# EAGLE design CO5-AT (EAGLE 9.6.2)
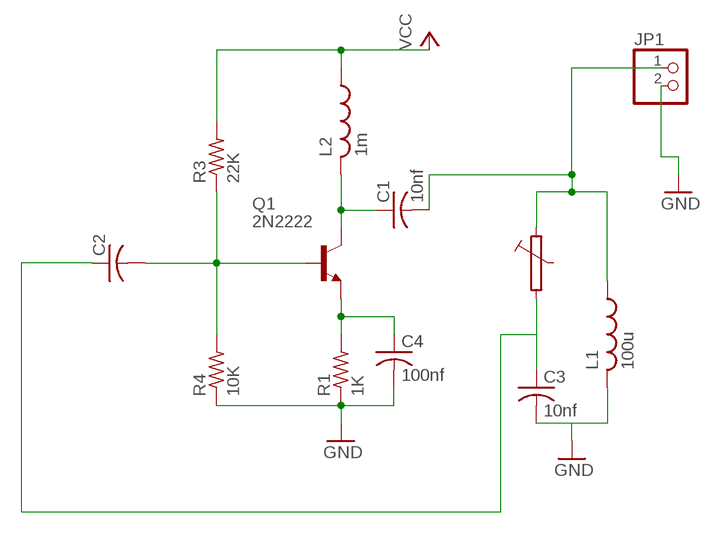
[diagram p0: schematic, sheet 1]

## Parts
C1  10nf  C-US050-025X075  [C050-025X075]
C2  C-US050-025X075  [C050-025X075]
C3  10nf  C-US050-025X075  [C050-025X075]
C4  100nf  C-US050-025X075  [C050-025X075]
JP1  PINHD-1X2  [1X02]
L1  100u  L-US0207/10  [0207/10]
L2  1m  L-US0207/10  [0207/10]
Q1  2N2222  [TO18]
R1  1K  R-US_0207/10  [0207/10]
R3  22K  R-US_0207/10  [0207/10]
R4  10K  R-US_0207/10  [0207/10]

## Nets
GND: C4.2 JP1.2 R1.1 R4.1
N$1: C1.1 L2.2 Q1.3(C)
N$2: C4.1 Q1.1(E) R1.2
N$3: C2.2 Q1.2(B) R3.1 R4.2
N$4: C2.1
N$5: C3.1
N$6: C1.2 JP1.1 L1.1
N$8: C3.2 L1.2
VCC: L2.1 R3.2

## Library data of the parts
C1-C4 = rcl:C-US: CAPACITOR, American symbol; SPICEPREFIX: C
JP1 = pinhead:PINHD-1X2: PIN HEADER
L1 L2 = rcl:L-US: INDUCTOR, American symbol; SPICEPREFIX: L
Q1 = transistor-npn:2N2222*: NPN Transistor
R1 R3 R4 = rcl:R-US_: RESISTOR, American symbol; SPICEPREFIX: R

## Board
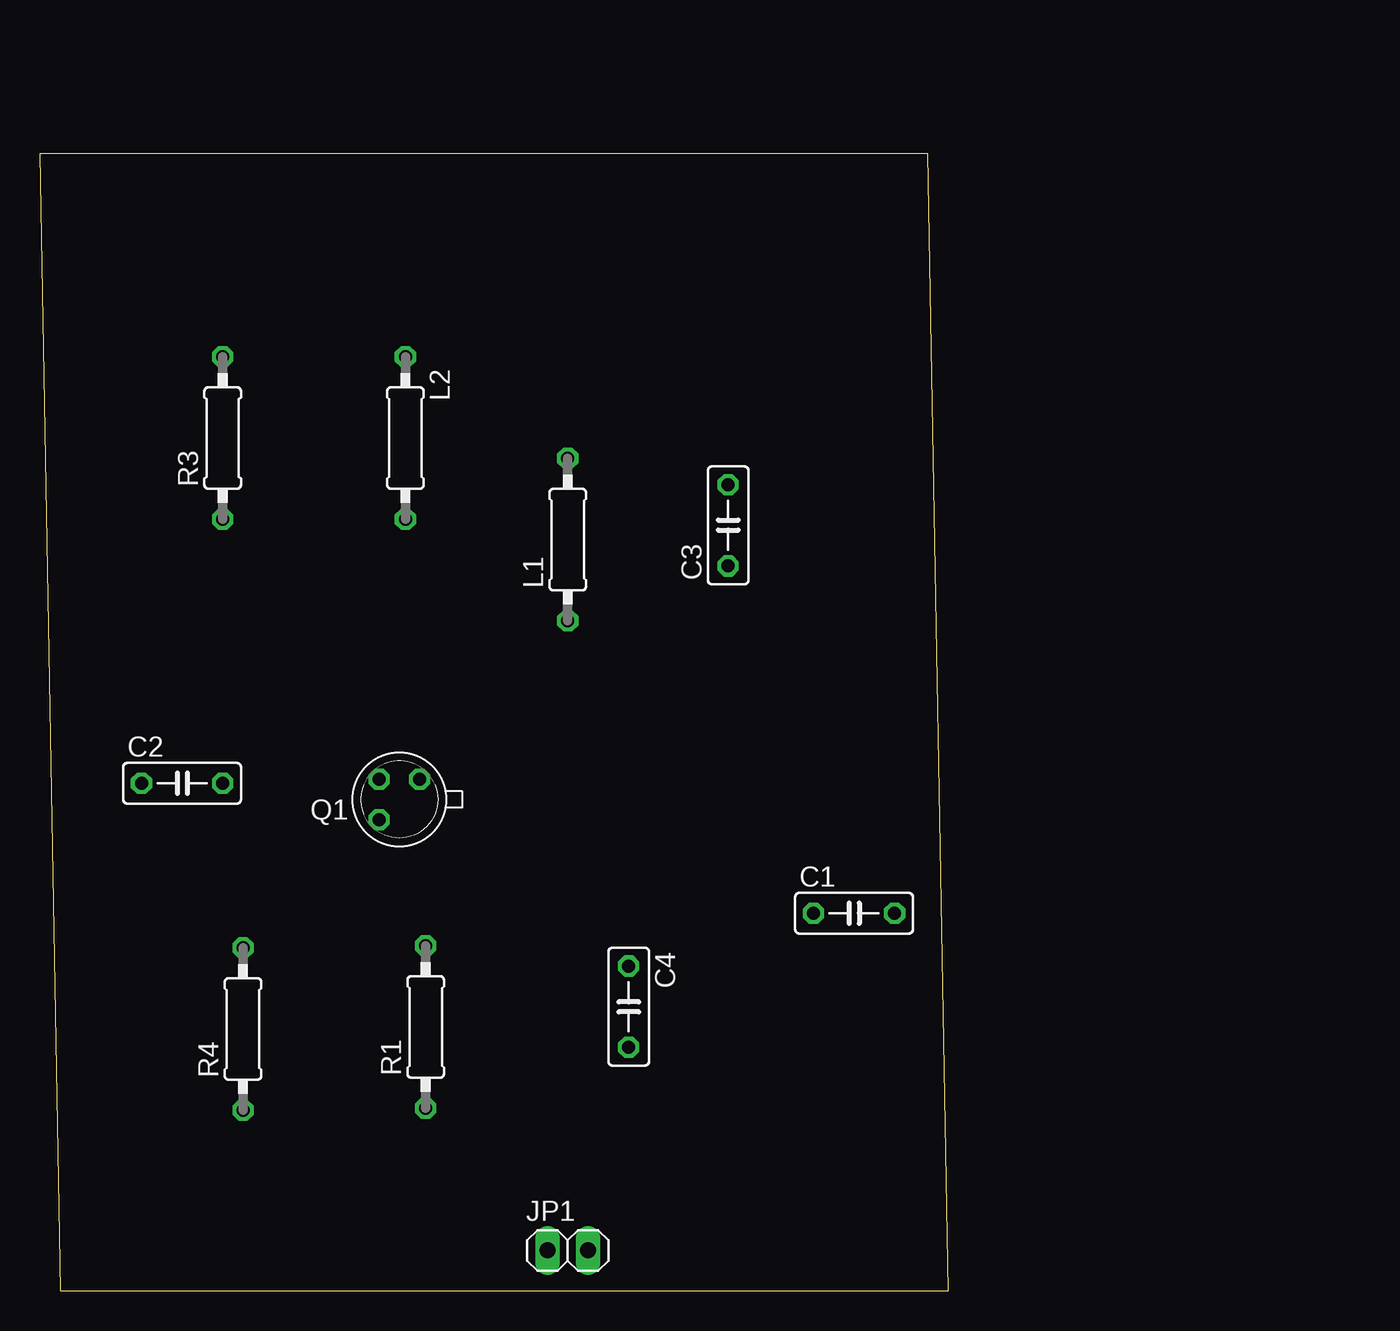
[diagram p1: board, top side]
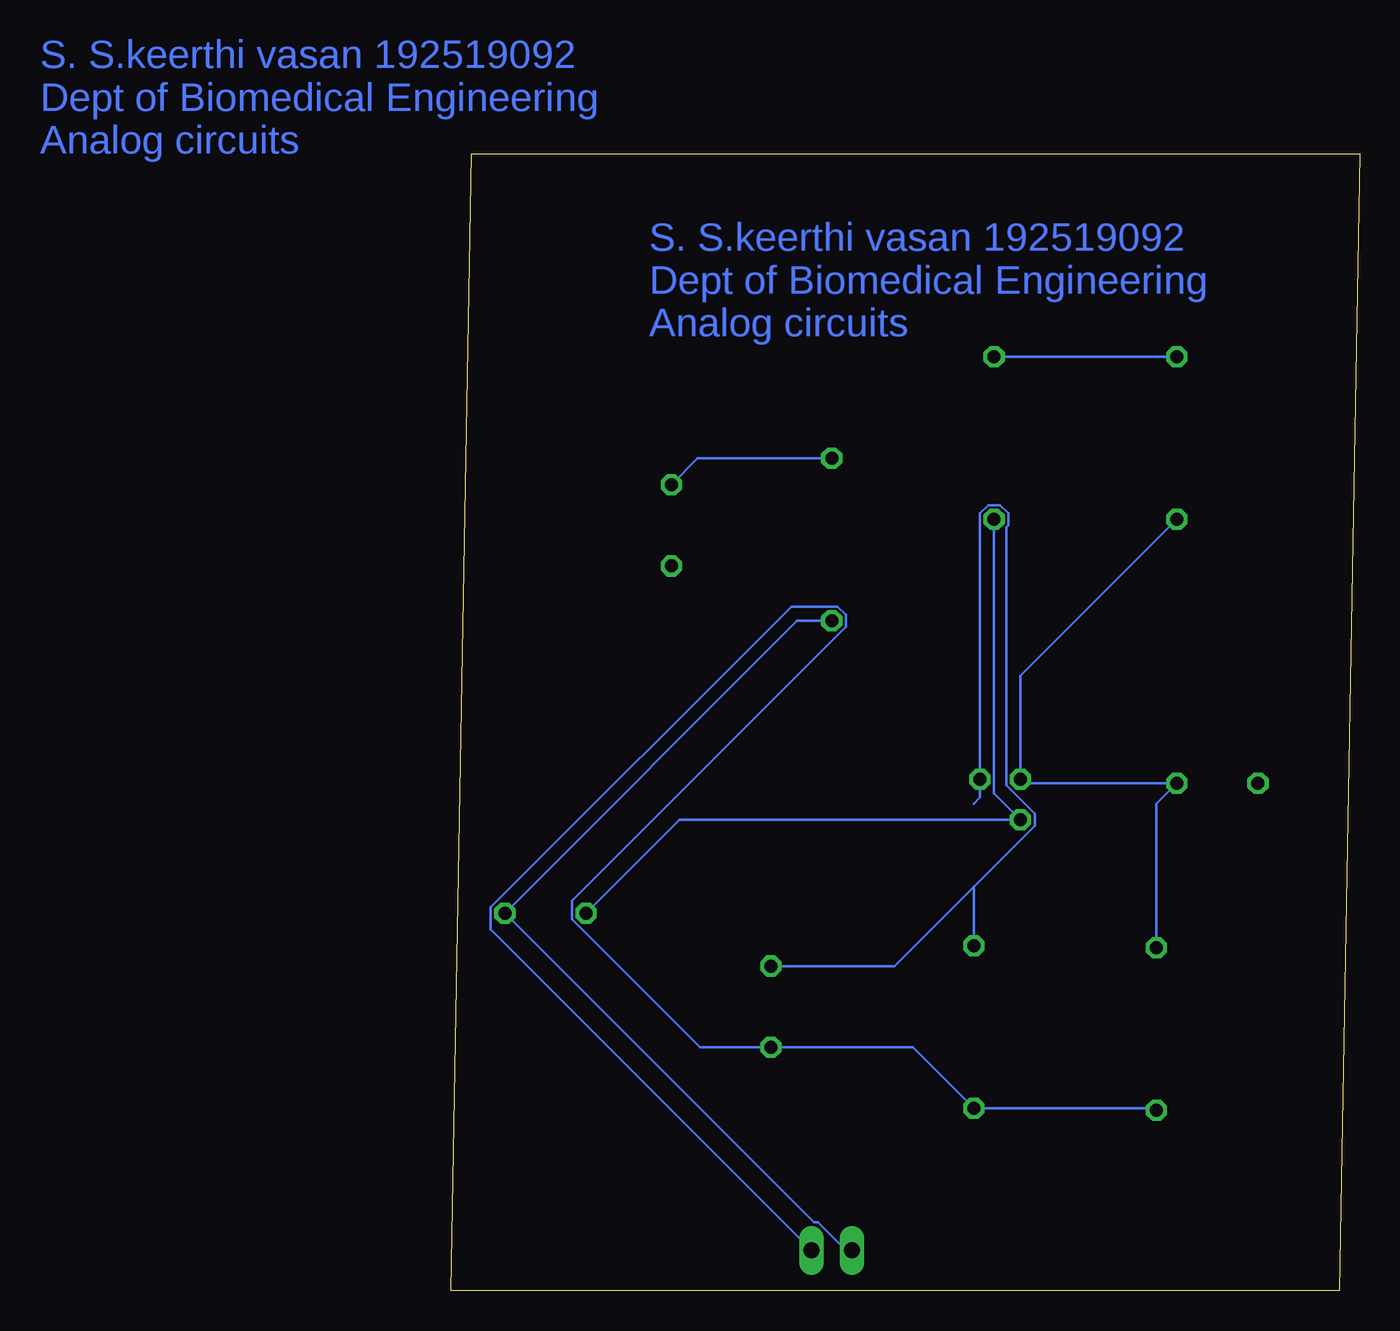
[diagram p2: board, bottom side, seen from below]

Size 56.82 x 71.11 mm. Coordinates in mm from the lower left corner, seen from the top.
Outline: 1.27,0 56.82,0 55.55,71.11 0,71.11 1.27,0
Copper layers (1*16): Top 0.035mm / dielectric 1.5mm / Bottom 0.035mm
Design rules "default": minimum track width 6mil, minimum drill 0.35mm, track to track 6mil, track to pad 6mil, pad to pad 6mil, via to via 6mil, smd to smd 6mil, copper to edge 40mil, drill to drill 6mil, minimum pad ring 10mil, minimum via ring 8mil, stop-mask expansion 4mil, vias tented up to drill 0mil, thermal gap 10mil

### Footprints (pad centres in the part's own frame; a part is rotated, then mirrored left to right if it is on the bottom)
C050-025X075 = drill 0.813 octagon: 1 -2.54,0; 2 2.54,0
1X02 = drill 1.016 long: 1 -1.27,0; 2 1.27,0
0207/10 = drill 0.813 octagon: 1 -5.08,0; 2 5.08,0
TO18 = drill 0.813 octagon: 1 -1.27,-1.27; 2 1.27,-1.27; 3 1.27,1.27

### Placement (x,y rotation side)
C1  50.93,23.62 0 top
C2  8.89,31.75 0 top
C3  43.05,47.88 90 top
C4  36.83,17.78 270 top
JP1  33.02,2.54 0 top
L1  33.02,46.99 90 top
L2  22.86,53.34 270 top
Q1  22.48,30.73 180 top
R1  24.13,16.51 90 top
R3  11.43,53.34 90 top
R4  12.7,16.38 90 top

### Tracks (layer width: path | path; a pad name or v marks a point on that pad's centre or on a via)
GND
  Bottom 0.152: R4.1 12.83,11.43 R1.1 27.94,15.24 C4.2 41.26,15.24 49.28,23.25 49.28,24.4 32.13,41.54 32.13,42.28 32.65,42.8 35.55,42.8 54.36,23.99 54.36,22.61 JP1.2
N$1
  Bottom 0.152: L2.2 22.86,31.12 Q1.3 42.55,29.46 C1.1
N$2
  Bottom 0.152: R1.2 24.13,25.29 | 24.13,25.29 20.32,29.1 20.32,29.83 22.1,31.61 22.1,47.77 21.97,47.89 21.97,48.63 22.49,49.15 23.23,49.15 23.75,48.63 Q1.1 23.75,30.86 24.13,30.48 | 24.13,25.29 29.1,20.32 C4.1
N$3
  Bottom 0.152: R4.2 12.7,30.48 C2.2 20.96,31.75 Q1.2 21.21,38.48 R3.1
N$6
  Bottom 0.152: JP1.1 32.13,2.54 33.88,4.29 34.14,4.29 C1.2 35.18,41.91 L1.1
N$8
  Bottom 0.152: L1.2 41.4,52.07 C3.2
VCC
  Bottom 0.152: R3.2 L2.1

### Text on the board
Bottom: S. S.keerthi vasan 192519092 / Dept of Biomedical Engineering / Analog circuits | S. S.keerthi vasan 192519092 / Dept of Biomedical Engineering / Analog circuits | S.S.Keerthi vasan 192519092 Dept of Biomedical Engineering Analogg circuits